# EAGLE design Amplifier (EAGLE 7.2.0)
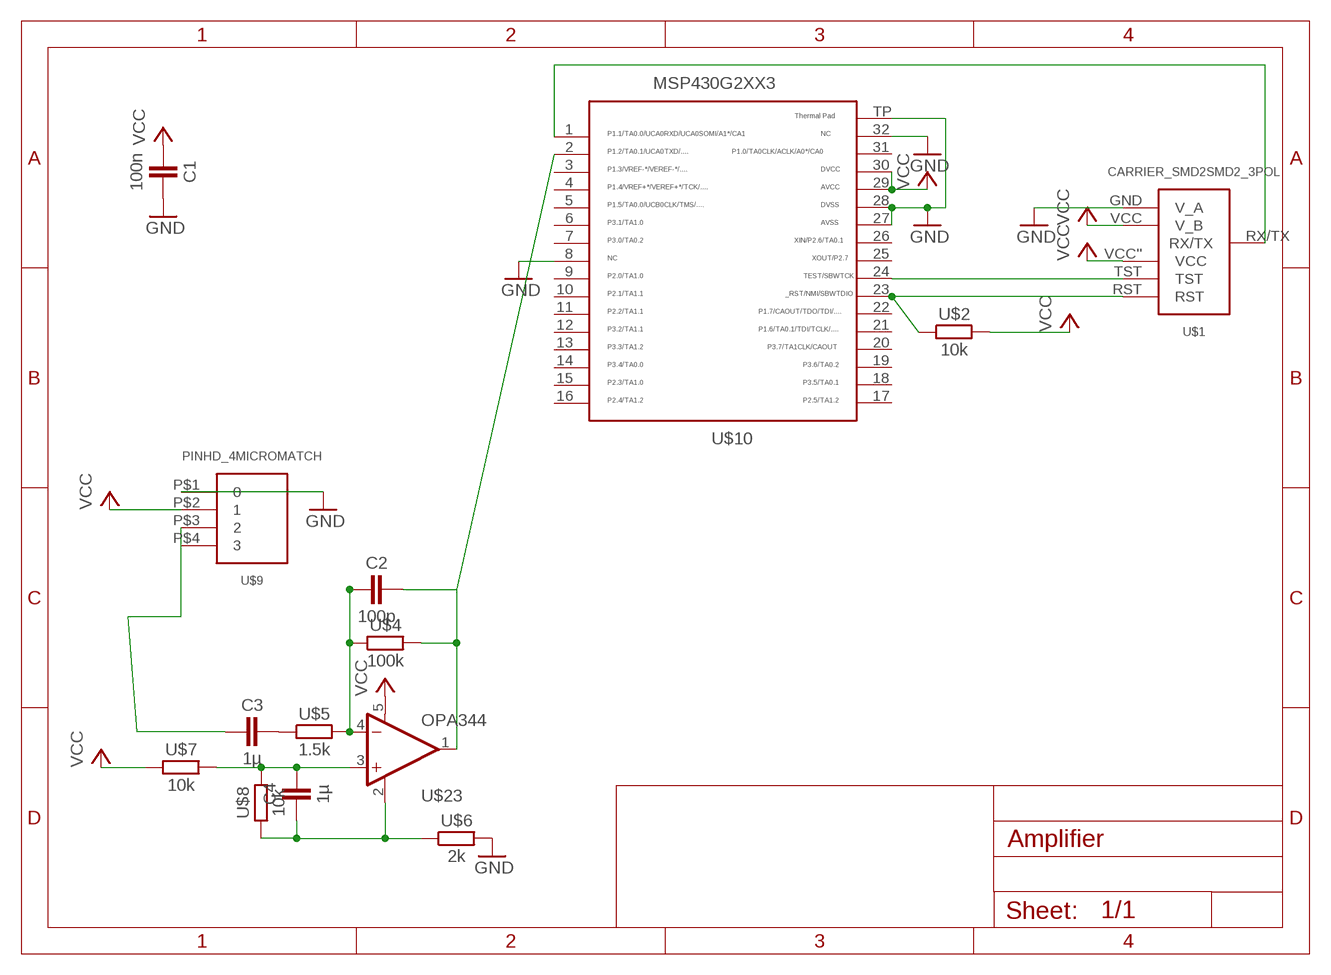
[diagram p0: schematic, sheet 1]

## Parts
C1  100n  CAPACITOR  [603]
C2  100p  CAPACITOR  [603]
C3  1µ  CAPACITOR  [603]
C4  1µ  CAPACITOR  [603]
U$1  CARRIER_SMD2SMD2_3POL  [CARRIER_SMD2_3POL]
U$2  10k  RESISTOR0603  [603]
U$4  100k  RESISTOR0603  [603]
U$5  1.5k  RESISTOR0603  [603]
U$6  2k  RESISTOR0603  [603]
U$7  10k  RESISTOR0603  [603]
U$8  10k  RESISTOR0603  [603]
U$9  PINHD_4MICROMATCH  [MICROMATCH4P0L]
U$10  MSP430G2553  [QFN32]
U$23  OPA344  [SOT23-5]

## Nets
GND: C1.2 U$1.GND(V_A) U$6.2 U$9.P$1 U$10.8 U$10.27 U$10.28 U$10.32 U$10.TP
N$3: U$1.TST U$10.24
N$4: U$1.RST U$2.1 U$10.23
N$12: U$1.RX/TX U$10.1
N$52: C2.1 U$4.1 U$5.2 U$23.4(-IN)
N$53: C3.2 U$5.1
N$55: C4.1 U$6.1 U$8.1 U$23.2(V-)
N$56: C3.1 U$9.P$3 U$9.P$4
N$57: C4.2 U$7.2 U$8.2 U$23.3(+IN)
SOUND: C2.2 U$4.2 U$10.2 U$23.1(OUT)
VCC: C1.1 U$1.VCC''(VCC) U$1.VCC(V_B) U$2.2 U$7.1 U$9.P$2 U$10.29 U$10.30 U$23.5(V+)
Unconnected: U$10.3 U$10.4 U$10.5 U$10.6 U$10.7 U$10.9 U$10.10 U$10.11 U$10.12 U$10.13 U$10.14 U$10.15 U$10.16 U$10.17 U$10.18 U$10.19 U$10.20 U$10.21 U$10.22 U$10.25 U$10.26 U$10.31

## Library data of the parts
C1-C4 = thar:CAPACITOR
U$1 = thar:CARRIER_SMD2
U$2 U$4-U$8 = thar:RESISTOR
U$9 = thar:PINHD_4
U$10 = thar:MSP430G2553: TEXAS INSTRUMENTS MSP430G2553IRHB32R MCU, 16BIT, MSP430, 16MHZ, QFN-32 Farnell Best.Nr.: 2325726 Herst.Bez.: MSP430G2553IRHB32R
U$23 = SparkFun-AnalogIC:OPA344: Single gate rail-to-rail output op-amp. Inputs extend 300mV past rails.

## Board
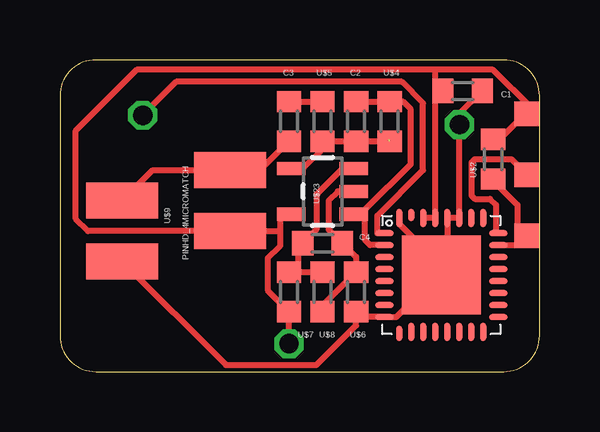
[diagram p1: board, top side]
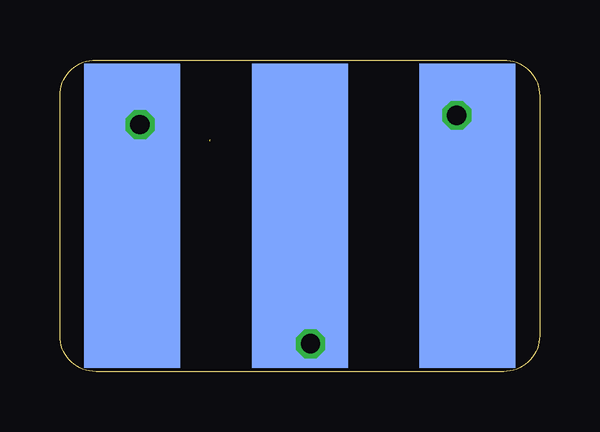
[diagram p2: board, bottom side, seen from below]

Size 20 x 13 mm. Coordinates in mm from the lower left corner, seen from the top.
Copper layers (1*16): Top 0.035mm / dielectric 1.5mm / Bottom 0.035mm
Design rules "Bilex DRU *": minimum track width 10mil, minimum drill 24mil, track to track 10mil, track to pad 10mil, pad to pad 10mil, via to via 10mil, smd to smd 10mil, copper to edge 1mil, drill to drill 8mil, minimum pad ring 10mil, minimum via ring 8mil, stop-mask expansion 4mil, vias tented up to drill 0mil, thermal gap 10mil

### Footprints (pad centres in the part's own frame; a part is rotated, then mirrored left to right if it is on the bottom)
603 = smd 0.889 x 1.016: 1 -0.826,0; 2 0.826,0
CARRIER_SMD2_3POL = smd 4 x 12.7 bottom: GND -6.985,0; RX/TX 6.985,0; VCC 0,0 | smd 1.016 x 1.016: RST -9.461,0.826; TST -9.461,-1.714; VCC'' -9.461,-4.255
MICROMATCH4P0L = smd 1.5 x 3: P$1 -1.905,2.25; P$2 -0.635,-2.25; P$3 0.635,2.25; P$4 1.905,-2.25
QFN32 = smd 0.762 x 0.254: 1 -2.375,1.75; 2 -2.375,1.25; 3 -2.375,0.75; 4 -2.375,0.25; 5 -2.375,-0.25; 6 -2.375,-0.75; 7 -2.375,-1.25; 8 -2.375,-1.75; 17 2.375,-1.75; 18 2.375,-1.25; 19 2.375,-0.75; 20 2.375,-0.25; 21 2.375,0.25; 22 2.375,0.75; 23 2.375,1.25; 24 2.375,1.75 | smd 0.254 x 0.635: 9 -1.75,-2.438 | smd 0.254 x 0.762: 10 -1.25,-2.375; 11 -0.75,-2.375; 12 -0.25,-2.375; 13 0.25,-2.375; 14 0.75,-2.375; 15 1.25,-2.375; 16 1.75,-2.375; 25 1.75,2.375; 26 1.25,2.375; 27 0.75,2.375; 28 0.25,2.375; 29 -0.25,2.375; 30 -0.75,2.375; 32 -1.75,2.375 | smd 0.254 x 0.508: 31 -1.25,2.5 | smd 3.302 x 3.302: TP 0,0
SOT23-5 = smd 0.55 x 1.2: 1 -0.95,-1.3; 2 0,-1.3; 3 0.95,-1.3; 4 0.95,1.3; 5 -0.95,1.3

### Placement (x,y rotation side)
C1  16.79,11.7 0 top
C2  12.35,10.43 90 top
C3  9.55,10.43 90 top
C4  10.95,5.35 180 top
U$1  10,6.5 180 top
U$2  18.06,8.86 90 top
U$4  13.74,10.43 90 top
U$5  10.95,10.43 270 top
U$6  12.35,3.32 270 top
U$7  9.55,3.32 90 top
U$8  10.95,3.32 90 top
U$9  4.85,6.5 90 top
U$10  15.9,4.03 0 top
U$23  10.95,7.51 90 top

### Tracks (layer width: path | path; a pad name or v marks a point on that pad's centre or on a via)
GND  (via drill 0.8)
  Top 0.254: 16.43,4.35 16.19,5.38 16.16,5.35 | 16.43,4.35 16.48,3.06 U$10.TP 15.01,2.94 14.89,3.14 14.03,2.28 U$10.8 12.69,2.28 | U$10.32 14.15,6.16 14.76,5.55 15.52,5.35 16.15,4.72 | 16.15,4.72 U$10.28 U$10.27 16.65,10.04 v16.66,10.31 16.66,10.75 C1.2 | 16.15,4.72 16.15,4.42 16.43,4.35 | 12.09,2.28 12.69,2.28 | 12.69,2.28 U$6.2 12.35,1.92 10.7,0.27 6.92,0.27 U$9.P$1
  Bottom 0.254: 18,6.5 17.81,6.69 v16.66,10.31 16.98,10.37 U$1.GND
N$3
  Top 0.254: 19.61,7.88 19.46,8.02 19.5,8.18 | U$10.24 18.19,5.78 18.19,6.95 17.93,7.21 17.3,7.21 17.17,7.33 17.17,8.73 17.3,8.86 18.82,8.86 19.5,8.18 | 19.5,8.18 U$1.TST
N$4
  Top 0.254: 19.46,5.48 19.5,5.38 | 19.46,5.48 19.5,5.69 19.08,5.74 19.08,6.95 18.06,7.97 U$2.1 | U$10.23 19.28,5.28 19.46,5.48 | U$1.RST 19.46,5.48
N$12  (via drill 0.8)
  Top 0.254: v3.46,10.69 4.85,12.09 14.25,12.09 15.14,11.2 15.14,8.4 13.24,6.5 13.24,5.78 U$10.1
  Bottom 0.254: 2.51,7.9 2.7,7.89 | 2.7,7.89 2.82,7.89 v3.46,10.69 | U$1.RX/TX 3.01,7.58 2.7,7.89
N$52  (1 unrouted)
  Top 0.254: 13.74,9.67 13.74,9.42 | U$4.1 C2.1 U$5.2 10.95,9.29 10.12,8.46 U$23.4
N$53
  Top 0.254: C3.2 U$5.1
N$55
  Top 0.254: U$23.2 11.59,7.51 11.2,7.13 11.2,5.93 C4.1 12.35,4.78 U$6.1 10.95,2.75 U$8.1
N$56
  Top 0.254: U$9.P$3 3.87,8.4 U$9.P$4 8.35,8.4 C3.1
N$57
  Top 0.254: U$23.3 11.77,8.46 10.7,7.39 10.7,5.93 C4.2 10.12,5.29 9.93,5.1 9.93,4.53 U$7.2 U$8.2
SOUND
  Top 0.254: C2.2 U$4.2 14.32,11.26 14.63,10.94 14.63,8.66 12.73,6.75 12.73,6.5 | U$10.2 12.93,5.28 12.73,5.48 12.73,6.5 | U$23.1 12.66,6.56 12.73,6.5
VCC  (via drill 0.8)
  Top 0.254: U$10.30 U$10.29 15.65,11.58 | 19.5,10.52 19.46,10.56 | U$2.2 18.12,9.48 19.2,10.56 19.2,10.51 19.46,10.56 | 19.46,10.56 19.65,10.75 19.65,11.01 18.06,12.59 15.65,12.59 | 15.65,12.59 3.2,12.59 0.66,10.05 0.66,6.37 1.17,5.86 U$9.P$2 9.17,5.86 | 19.46,10.56 U$1.VCC'' | 15.65,11.58 15.65,12.59 | C1.1 15.71,11.7 15.65,11.58 | v9.55,1.16 U$7.1 8.66,3.39 8.66,4.72 9.17,5.23 9.17,5.86 | U$23.5 9.49,6.56 9.43,6.5 9.17,6.5 | 9.17,6.5 9.17,5.86 | 9.17,6.5 9.17,6.62
  Bottom 0.254: U$1.VCC 10.25,5.67 | 10.25,5.67 v9.55,1.16 10.38,1.73 10.25,5.67